# EAGLE design TARGET_xDOT (EAGLE 7.6.0)
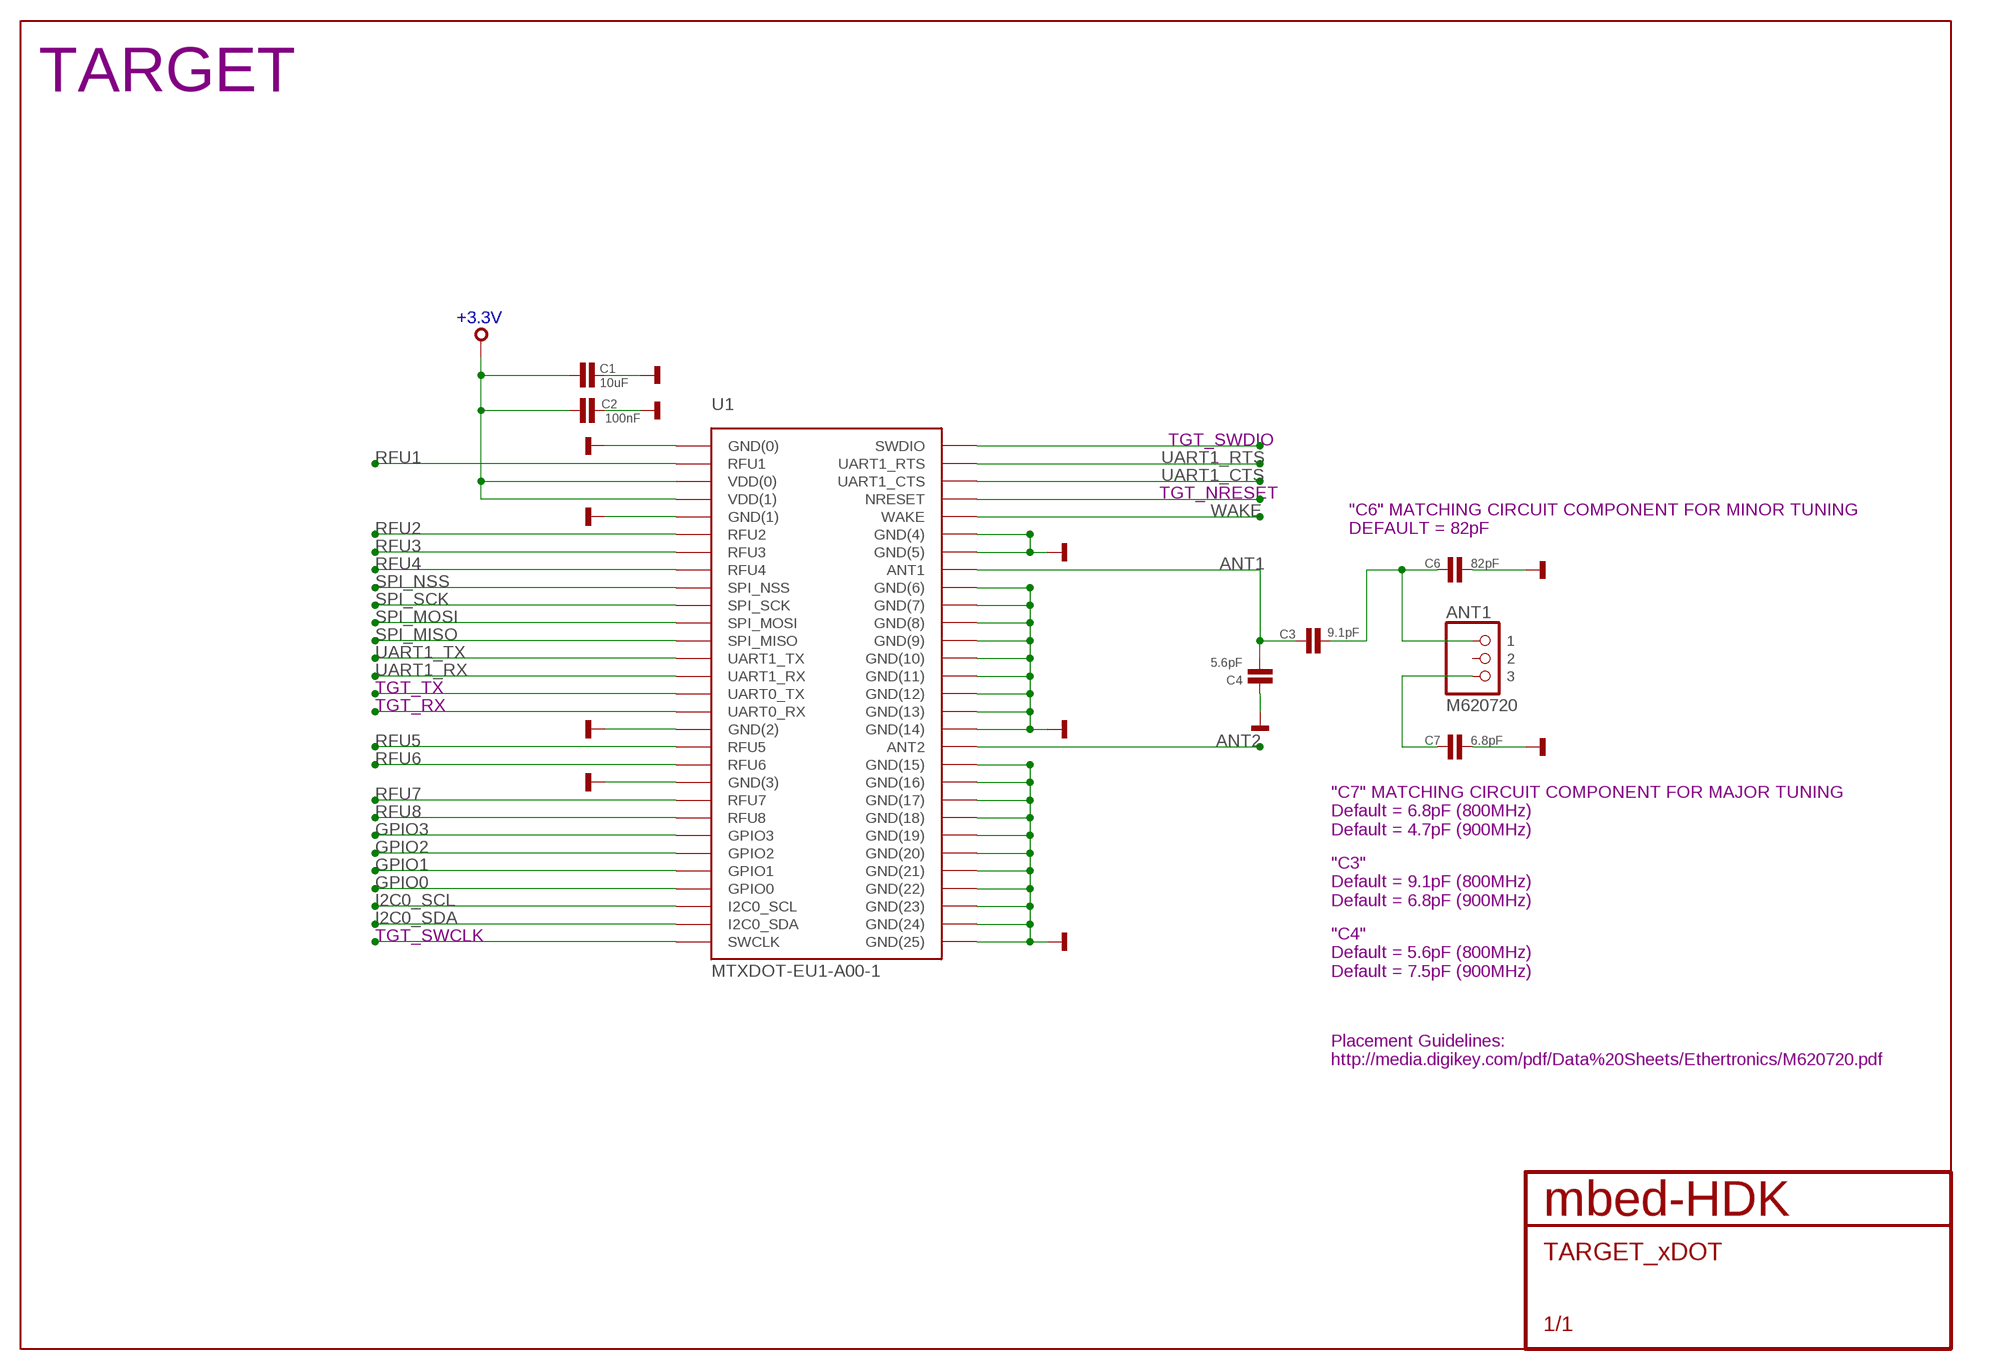
[diagram p0: schematic, sheet 1]

## Parts
ANT1  M620720  [M620720]
C1  10uF  CAPACITOR0603  [0603]
C2  100nF  CAPACITOR0603  [0603]
C3  9.1pF  CAPACITOR0402  [0402]
C4  5.6pF  CAPACITOR0402  [0402]
C6  82pF  CAPACITOR0402  [0402]
C7  6.8pF  CAPACITOR0402  [0402]
U1  MTXDOT-EU1-A00-1  [MTXDOT-EU1/NA1-A00-1]

## Nets
+3.3V: C1.1 C2.1 U1.P$3(VDD(0)) U1.P$4(VDD(1))
ANT1: C3.1 C4.2 U1.P$37(ANT1)
ANT2: U1.P$47(ANT2)
GND: C1.2 C2.2 C4.1 C6.1 C7.1 U1.P$1(GND(0)) U1.P$5(GND(1)) U1.P$17(GND(2)) U1.P$20(GND(3)) U1.P$35(GND(4)) U1.P$36(GND(5)) U1.P$38(GND(6)) U1.P$39(GND(7)) U1.P$40(GND(8)) U1.P$41(GND(9)) U1.P$42(GND(10)) U1.P$43(GND(11)) U1.P$44(GND(12)) U1.P$45(GND(13)) U1.P$46(GND(14)) U1.P$48(GND(15)) U1.P$49(GND(16)) U1.P$50(GND(17)) U1.P$51(GND(18)) U1.P$52(GND(19)) U1.P$53(GND(20)) U1.P$54(GND(21)) U1.P$55(GND(22)) U1.P$56(GND(23)) U1.P$57(GND(24)) U1.P$58(GND(25))
GPIO0: U1.P$26(GPIO0)
GPIO1: U1.P$25(GPIO1)
GPIO2: U1.P$24(GPIO2)
GPIO3: U1.P$23(GPIO3)
I2C0_SCL: U1.P$27(I2C0_SCL)
I2C0_SDA: U1.P$28(I2C0_SDA)
N$1: ANT1.P$3 C7.2
N$4: ANT1.P$1 C3.2 C6.2
RFU1: U1.P$2(RFU1)
RFU2: U1.P$6(RFU2)
RFU3: U1.P$7(RFU3)
RFU4: U1.P$8(RFU4)
RFU5: U1.P$18(RFU5)
RFU6: U1.P$19(RFU6)
RFU7: U1.P$21(RFU7)
RFU8: U1.P$22(RFU8)
SPI_MISO: U1.P$12(SPI_MISO)
SPI_MOSI: U1.P$11(SPI_MOSI)
SPI_NSS: U1.P$9(SPI_NSS)
SPI_SCK: U1.P$10(SPI_SCK)
TGT_NRESET: U1.P$33(NRESET)
TGT_RX: U1.P$16(UART0_RX)
TGT_SWCLK: U1.P$29(SWCLK)
TGT_SWDIO: U1.P$30(SWDIO)
TGT_TX: U1.P$15(UART0_TX)
UART1_CTS: U1.P$32(UART1_CTS)
UART1_RTS: U1.P$31(UART1_RTS)
UART1_RX: U1.P$14(UART1_RX)
UART1_TX: U1.P$13(UART1_TX)
WAKE: U1.P$34(WAKE)
Unconnected: ANT1.P$2

## Notes on the sheet
- TARGET
- "C6" MATCHING CIRCUIT COMPONENT FOR MINOR TUNING
  DEFAULT = 82pF
- "C7" MATCHING CIRCUIT COMPONENT FOR MAJOR TUNING
  Default = 6.8pF (800MHz)
  Default = 4.7pF (900MHz)
- "C3" 
  Default = 9.1pF (800MHz)
  Default = 6.8pF (900MHz)
- "C4" 
  Default = 5.6pF (800MHz)
  Default = 7.5pF (900MHz)
- Placement Guidelines:
  http://media.digikey.com/pdf/Data%20Sheets/Ethertronics/M620720.pdf

## Library data of the parts
ANT1 = mbed-HDK-RF:M620720: Chip Antenna Ceramic ISM/M2M/IoT 868/915MHz; MF: Ethertronics; MFN: M620720; OC-DIGIKEY: 939-1066-1-ND
C1-C4 C6 C7 = mbed-HDK-RLCQ:CAPACITOR: Capacitor
U1 = mbed-HDK-MF-MULTITECH:MTXDOT-EU1-A00-1: Multitech xDOT LORA MODULE UFL/TRC 868MHz for Europe; MF: Multi-Tech Systems Inc.; MFN: MTXDOT-EU1-A00-1; OC-DIGIKEY: 591-1292-ND

## Board
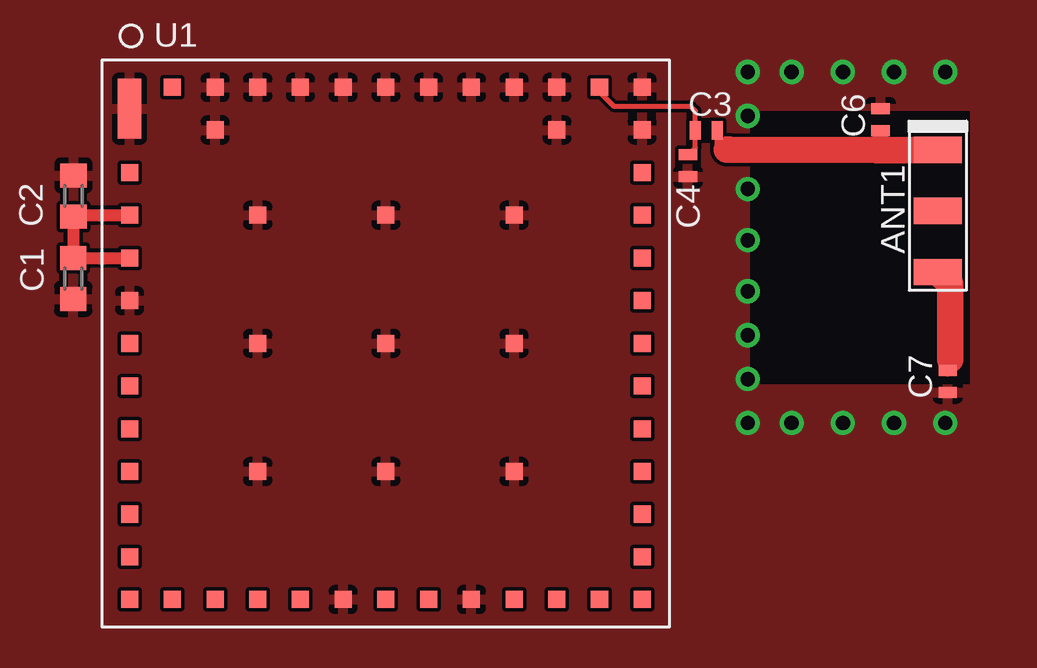
[diagram p1: board, top side]
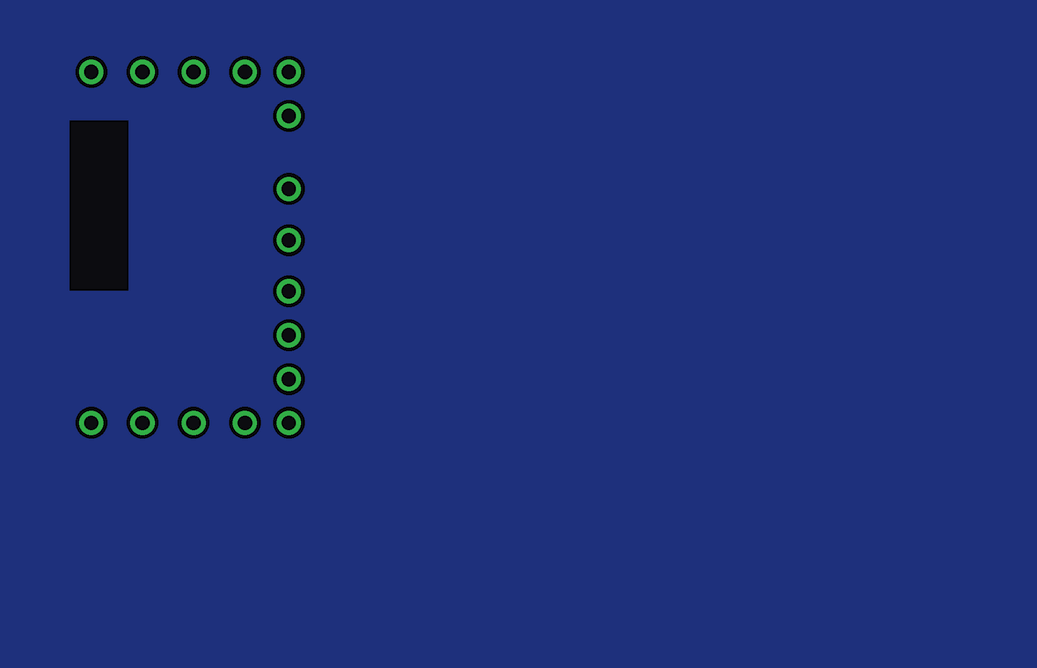
[diagram p2: board, bottom side, seen from below]

No outline drawn. Coordinates in mm, seen from the top.
Copper layers ((1*16)): Top 0.035mm / dielectric 0.8mm / Bottom 0.035mm
Design rules "mbed-HDK-6-6-2-layer": minimum track width 6mil, minimum drill 9mil, track to track 6mil, track to pad 6mil, pad to pad 6mil, via to via 6mil, smd to smd 6mil, copper to edge 15mil, drill to drill 8mil, minimum pad ring 10mil, minimum via ring 8mil, stop-mask expansion 4mil, vias tented up to drill 0mil, thermal gap 10mil
tRestrict: area 31.2,11.4 to 40.3,22.8

### Footprints (pad centres in the part's own frame; a part is rotated, then mirrored left to right if it is on the bottom)
M620720 = smd 1.1 x 2: P$1 -2.55,0; P$2 0,0; P$3 2.55,0
0603 = smd 1 x 1.1: 1 -0.85,0; 2 0.85,0
0402 = smd 0.457 x 0.762: 1 -0.457,0; 2 0.457,0
MTXDOT-EU1/NA1-A00-1 = smd 0.97 x 2.49: P$1 0,0 | smd 0.71 x 0.71: P$2 0,-2.67; P$3 0,-4.45; P$4 0,-6.23; P$5 0,-8.01; P$6 0,-9.79; P$7 0,-11.57; P$8 0,-13.35; P$9 0,-15.13; P$10 0,-16.91; P$11 0,-18.69; P$12 0,-20.47; P$13 1.78,-20.47; P$14 3.56,-20.47; P$15 5.34,-20.47; P$16 7.12,-20.47; P$17 8.9,-20.47; P$18 10.68,-20.47; P$19 12.46,-20.47; P$20 14.24,-20.47; P$21 16.02,-20.47; P$22 17.8,-20.47; P$23 19.58,-20.47; P$24 21.36,-20.47; P$25 21.36,-18.69; P$26 21.36,-16.91; P$27 21.36,-15.13; P$28 21.36,-13.35; P$29 21.36,-11.57; P$30 21.36,-9.79; P$31 21.36,-8.01; P$32 21.36,-6.23; P$33 21.36,-4.45; P$34 21.36,-2.67; P$35 21.36,-0.89; P$36 21.36,0.89; P$37 19.58,0.89; P$38 17.8,0.89; P$39 16.02,0.89; P$40 14.24,0.89; P$41 12.46,0.89; P$42 10.68,0.89; P$43 8.9,0.89; P$44 7.12,0.89; P$45 5.34,0.89; P$46 3.56,0.89; P$47 1.78,0.89; P$48 17.8,-0.89; P$49 3.56,-0.89; P$50 5.34,-4.45; P$51 10.68,-4.45; P$52 16.02,-4.45; P$53 5.34,-9.79; P$54 10.68,-9.79; P$55 16.02,-9.79; P$56 5.34,-15.13; P$57 10.68,-15.13; P$58 16.02,-15.13

### Placement (x,y rotation side)
ANT1  39.01,18.59 270 top
C1  2.98,15.77 270 top
C2  3,19.22 90 top
C3  29.36,21.95 0 top
C4  28.6,20.47 90 top
C6  36.63,22.4 270 top
C7  39.42,11.48 90 top
U1  5.33,22.86 0 top

### Tracks (layer width: path | path; a pad name or v marks a point on that pad's centre or on a via)
+3.3V
  Top 0.508: U1.P$3 3.04,18.41 C2.1 2.98,18.35 C1.1 2.99,16.63 U1.P$4
  pour Bottom: -64,-43 92,-43 92,68.5 -64,68.5
ANT1
  Top 0.203: U1.P$37 24.91,23.55 25.5,22.96 28.7,22.96 28.91,22.76 C3.1 28.91,21.23 C4.2
GND  (via drill 0.6)
  other vias: 39.32,9.75 37.19,9.75 35.05,9.75 32.92,9.75 31.09,9.75 31.09,11.58 31.09,13.41 31.09,15.24 31.09,17.37 31.09,19.51 31.09,22.56 31.09,24.38 32.92,24.38 35.05,24.38 37.19,24.38 39.32,24.38
  pour Top: -64,-42.5 92.5,-43 94,68 -62.5,68.5
N$1
  Top 0.508: 39.52,12.39 39.42,12.29 C7.2
  Top 1.1: ANT1.P$3 39.52,15.54 39.52,12.39
N$4
  Top 0.203: C3.2 29.82,21.13 30.32,21.13 30.33,21.14 | C6.2 36.68,21.89 36.68,21.74 | 30.21,21.14 30.24,20.93
  Top 0.508: 36.68,21.74 36.47,21.54 36.47,21.13
  Top 1.1: ANT1.P$1 36.47,21.13 30.33,21.14 30.21,21.14